# Altium schematic sheet Sensors.SchDoc
size A4
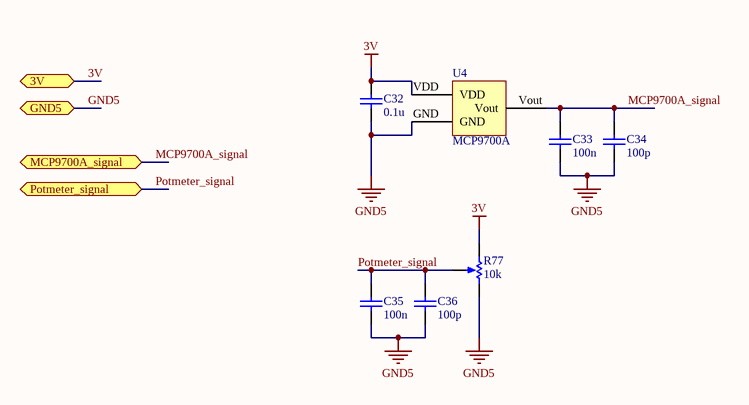
[diagram p0: Sensors.SchDoc]

## Parts
C32  0.1u  [0805C]
C33  100n  [0805C]
C34  100p  [0805C]
C35  100n  [0805C]
C36  100p  [0805C]
R77  10k  [TRIM_POT]
U4  MCP9700A  [TO-92]

## Ports
3V, GND5, MCP9700A_signal, Potmeter_signal

## Nets
3V: C32.2 R77.1 U4.VDD ; port 3V
GND5: C32.1 C33.1 C34.1 C35.1 C36.1 R77.0 U4.GND ; port GND5
MCP9700A_signal: C33.2 C34.2 U4.Vout ; port MCP9700A_signal
Potmeter_signal: C35.2 C36.2 R77.2 ; port Potmeter_signal

## Library data of the parts
C32-C36 = CAPACITOR
  C32: Value: 0.1u
  C33 C35: Value: 100n
  C34 C36: Value: 100p
R77 = Trim_pot: Value: 10k
U4 = MCP9700A: HESTORE: 1003.3751; FARNELL: 1332164